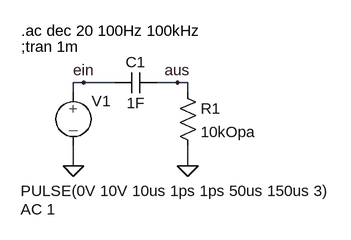
[diagram p0: schematic rc-hochpass.asc]
rc-hochpass.asc, the LTspice schematic file:
Version 4
SHEET 1 880 680
WIRE 128 128 112 128
WIRE 176 128 128 128
WIRE 272 128 240 128
WIRE 288 128 272 128
WIRE 112 144 112 128
WIRE 288 144 288 128
WIRE 112 256 112 224
WIRE 288 256 288 224
FLAG 288 256 0
FLAG 112 256 0
FLAG 128 128 ein
FLAG 272 128 aus
SYMBOL res 272 128 R0
SYMATTR InstName R1
SYMATTR Value 10kOpa
SYMBOL cap 176 144 R270
WINDOW 0 32 32 VTop 2
WINDOW 3 0 32 VBottom 2
SYMATTR InstName C1
SYMATTR Value 1F
SYMBOL source-V 112 128 R0
WINDOW 3 -81 167 Left 2
WINDOW 123 -81 195 Left 2
WINDOW 39 0 0 Left 2
SYMATTR InstName V1
SYMATTR Value PULSE(0V 10V 10us 1ps 1ps 50us 150us 3)
SYMATTR Value2 AC 1
TEXT 32 72 Left 2 !;tran 1m
TEXT 32 48 Left 2 !.ac dec 20 100Hz 100kHz

The netlist it stands for:
* rc-hochpass.asc
R1 aus 0 10kOpa
C1 ein aus 1F
V1 ein 0 PULSE(0V 10V 10us 1ps 1ps 50us 150us 3) AC 1
;tran 1m
.ac dec 20 100Hz 100kHz
.backanno
.end